# Altium schematic sheet [01] - COVER PAGE.SchDoc
size A3; DocumentNumber: 1; SheetNumber: 1; SheetTotal: 31
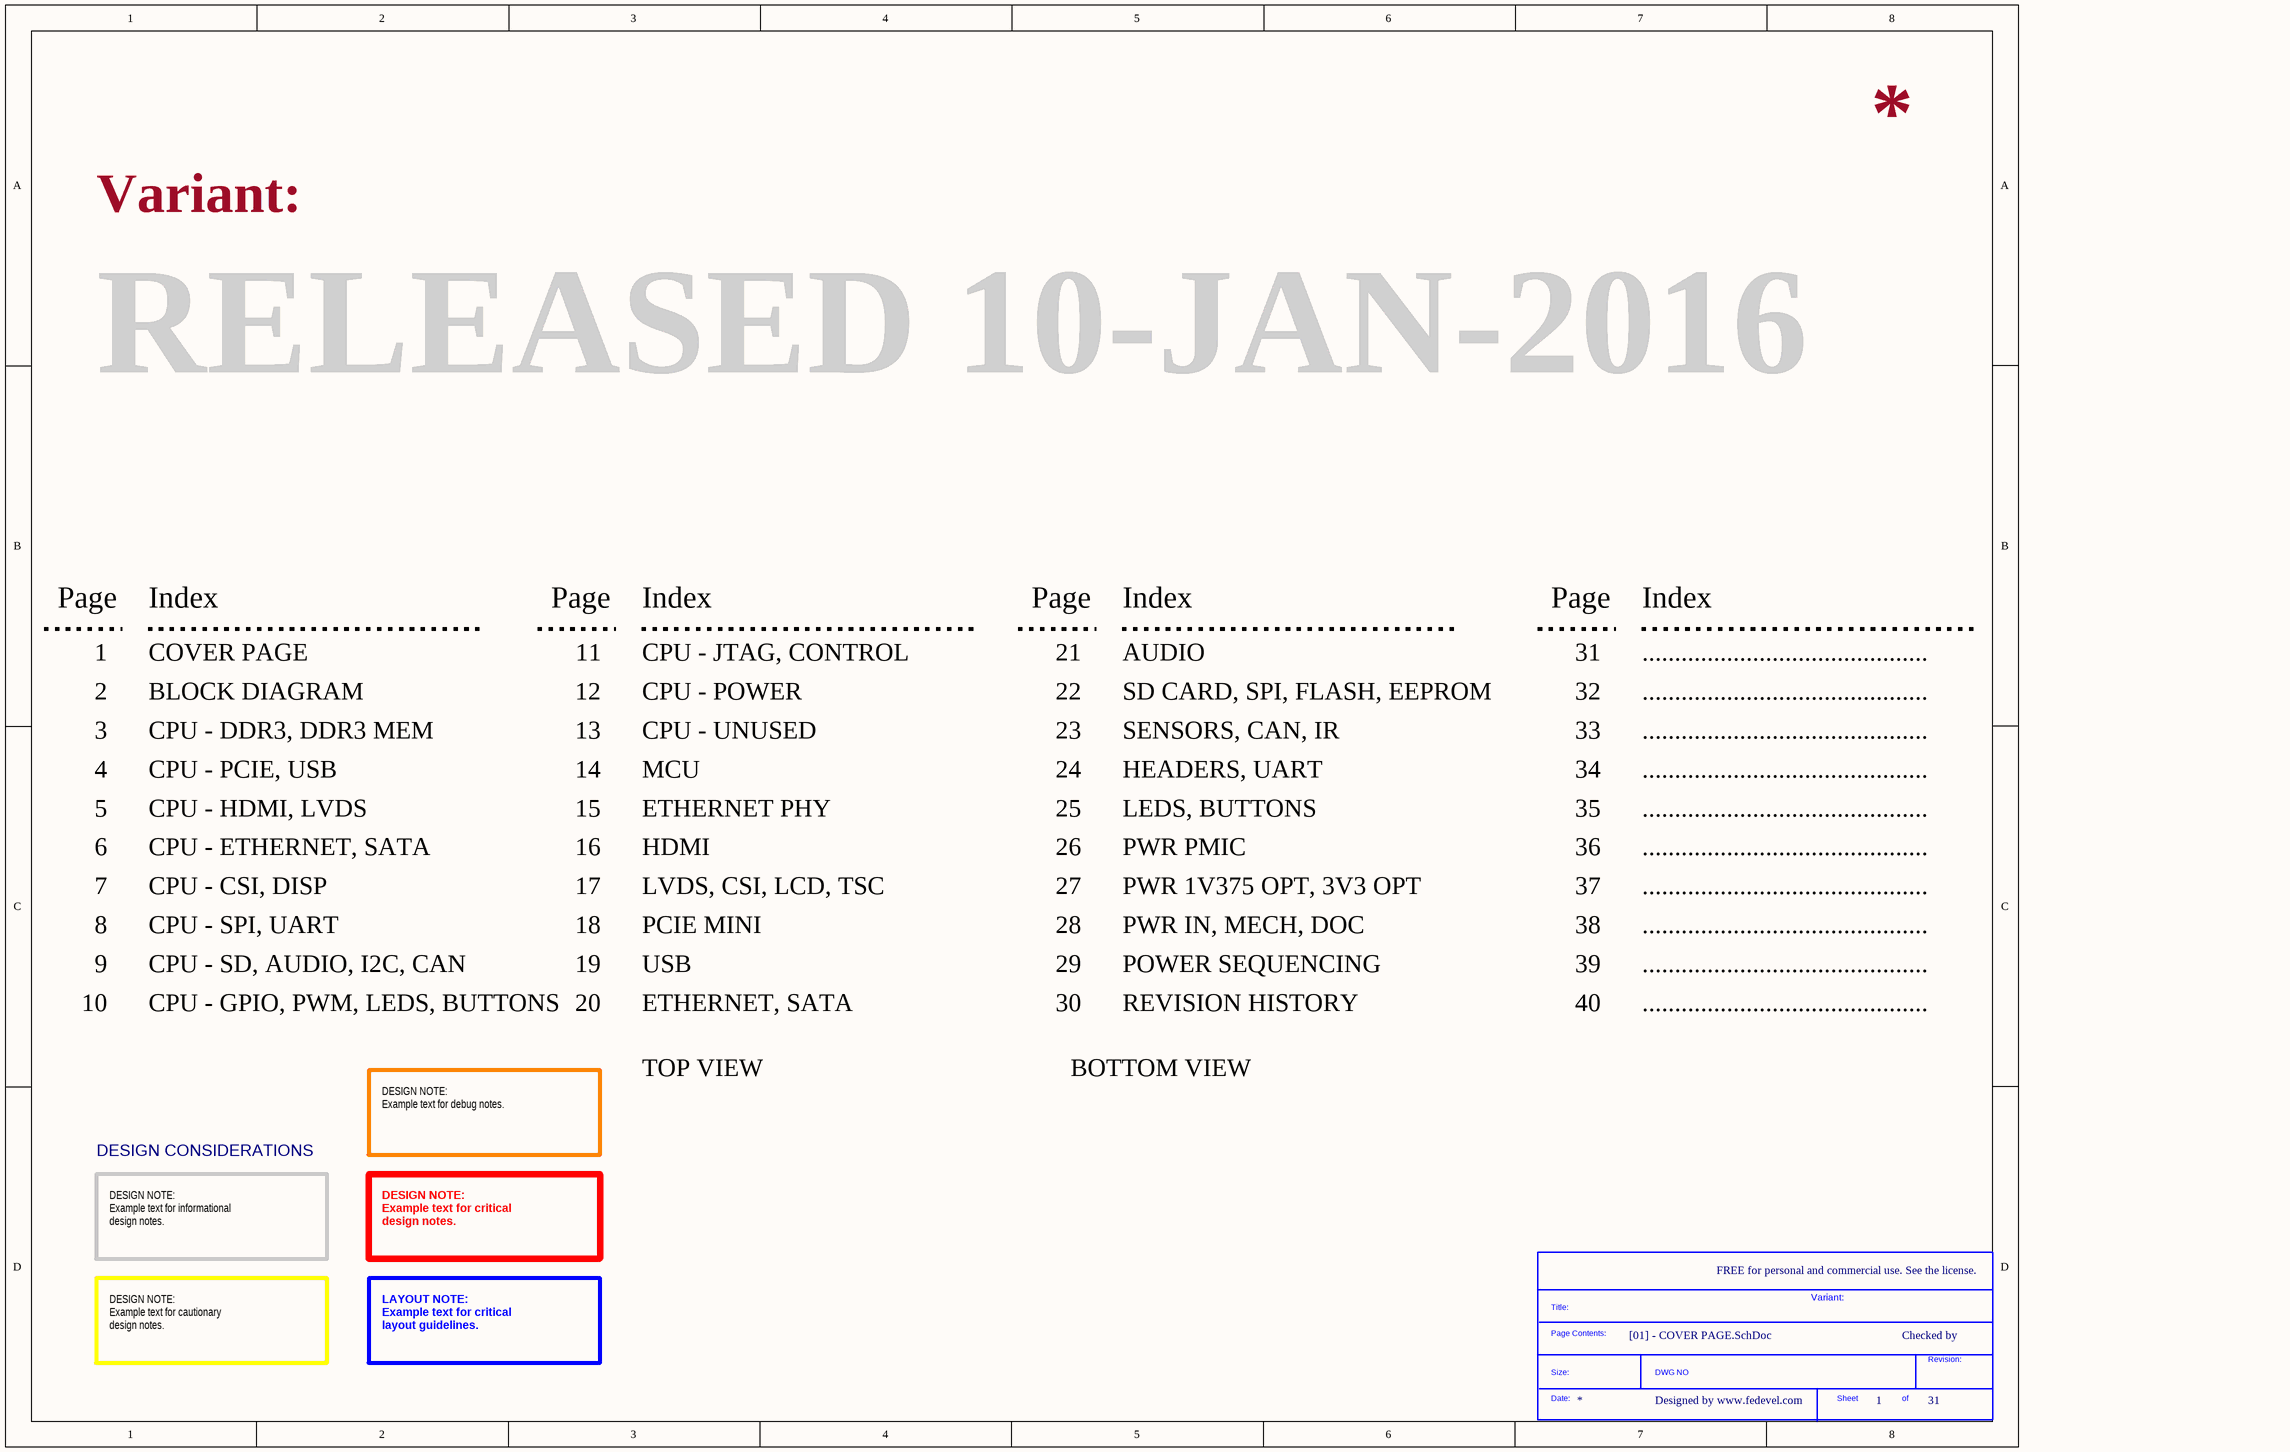
[diagram p0: [01] - COVER PAGE.SchDoc]

## Parts
*  SDTitleBlock  (value not drawn)  (graphical)

## Notes on the sheet
- Variant:
- RELEASED 10-JAN-2016
- Page
- Index
- 1
- COVER PAGE
- 11
- CPU - JTAG, CONTROL
- 21
- AUDIO
- 31
- ............................................
- 2
- 3
- BLOCK DIAGRAM
- CPU - DDR3, DDR3 MEM
- 12
- 13
- CPU - POWER
- CPU - UNUSED
- 22
- 23
- SD CARD, SPI, FLASH, EEPROM
- SENSORS, CAN, IR
- 32
- 33
- 4
- 5
- CPU - PCIE, USB
- CPU - HDMI, LVDS
- 14
- 15
- MCU
- ETHERNET PHY
- 24
- 25
- HEADERS, UART
- LEDS, BUTTONS
- 34
- 35
- 6
- CPU - ETHERNET, SATA
- 16
- HDMI
- 26
- PWR PMIC
- 36
- 7
- 8
- CPU - SPI, UART
- CPU - CSI, DISP
- 17
- 18
- LVDS, CSI, LCD, TSC
- PCIE MINI
- 27
- 28
- PWR 1V375 OPT, 3V3 OPT
- PWR IN, MECH, DOC
- 37
- 38
- 9
- 10
- CPU - SD, AUDIO, I2C, CAN
- CPU - GPIO, PWM, LEDS, BUTTONS
- 19
- 20
- USB
- ETHERNET, SATA
- 29
- 30
- POWER SEQUENCING
- REVISION HISTORY
- 39
- 40
- TOP VIEW
- BOTTOM VIEW
- DESIGN NOTE:
  Example text for debug notes.
- DESIGN CONSIDERATIONS
- DESIGN NOTE:
  Example text for informational
  design notes.
- DESIGN NOTE:
  Example text for critical
  design notes.
- FREE for personal and commercial use. See the license.
- Checked by
- DESIGN NOTE:
  Example text for cautionary
  design notes.
- LAYOUT NOTE:
  Example text for critical
  layout guidelines.
- Designed by www.fedevel.com
- (in symbol SDTitleBlock) Title:; Page Contents:; Revision:; Size:; DWG NO; Date:; Sheet; of